# EAGLE design DAC Breakout Board_6 (EAGLE 9.6.2)
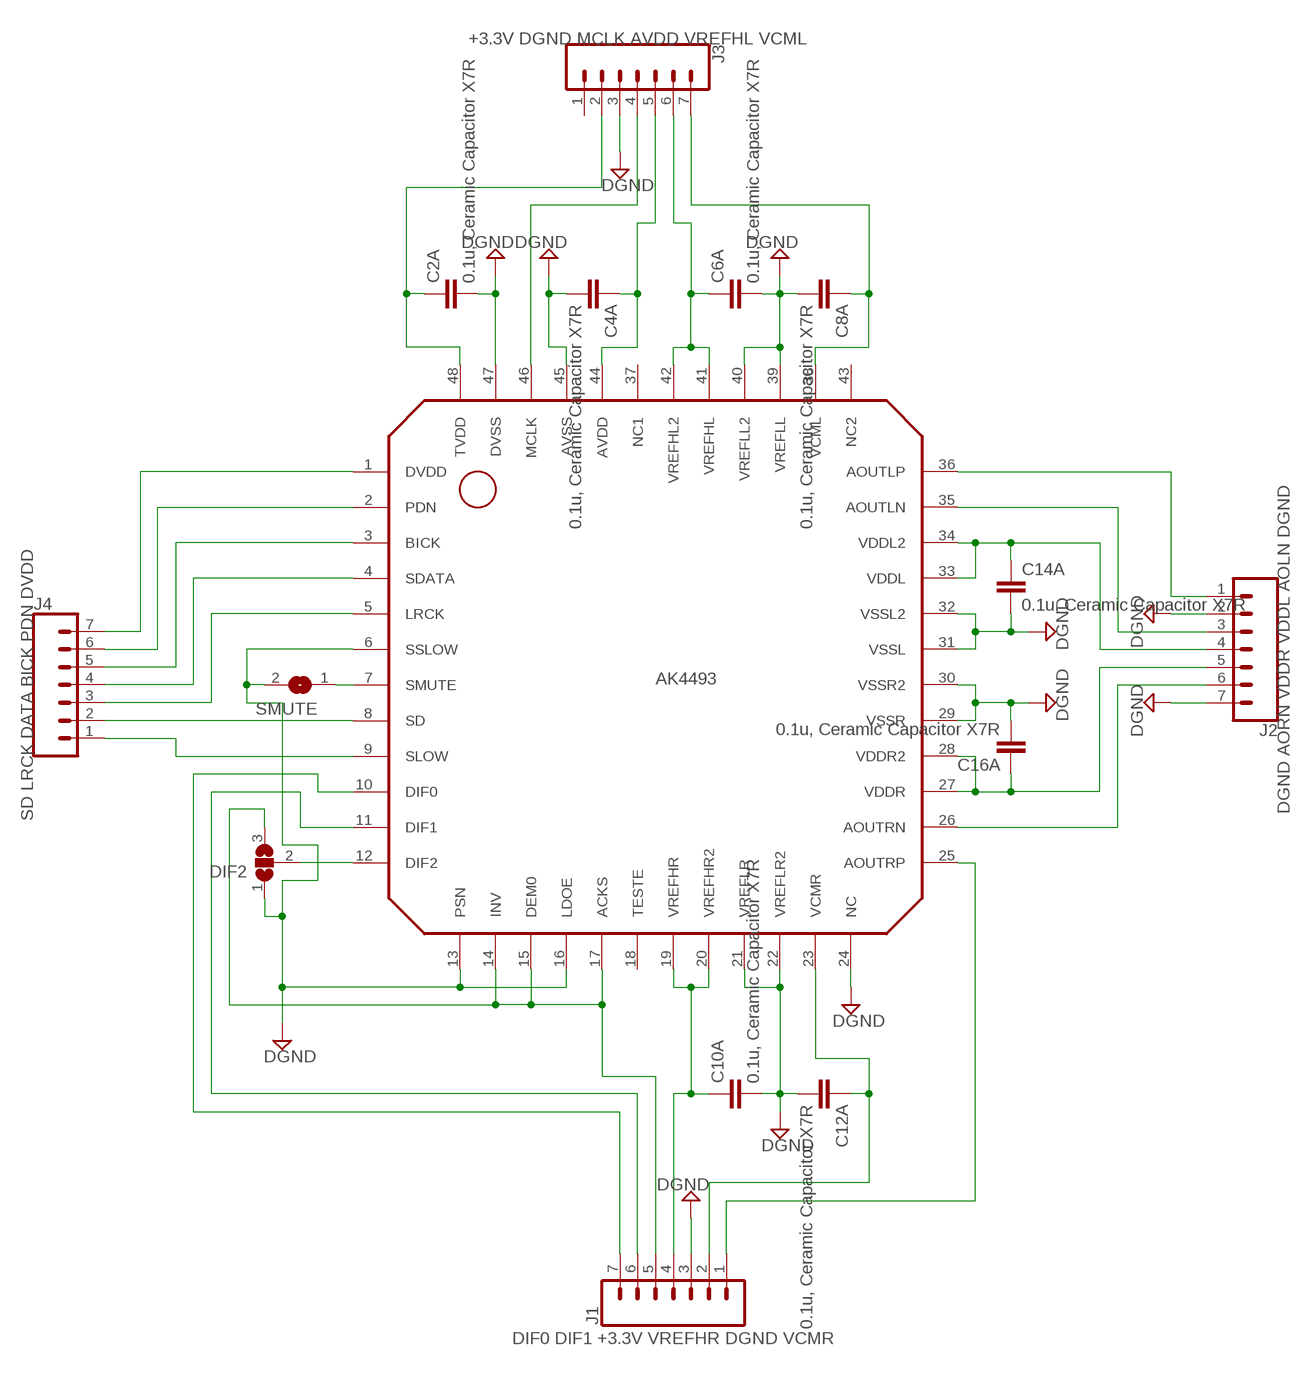
[diagram p0: schematic, sheet 1]

## Parts
C2A  0.1u, Ceramic Capacitor X7R  C-EUC0603K  [C0603K]
C4A  0.1u, Ceramic Capacitor X7R  C-EUC0603K  [C0603K]
C6A  0.1u, Ceramic Capacitor X7R  C-EUC0603K  [C0603K]
C8A  0.1u, Ceramic Capacitor X7R  C-EUC0603K  [C0603K]
C10A  0.1u, Ceramic Capacitor X7R  C-EUC0603K  [C0603K]
C12A  0.1u, Ceramic Capacitor X7R  C-EUC0603K  [C0603K]
C14A  0.1u, Ceramic Capacitor X7R  C-EUC0603K  [C0603K]
C16A  0.1u, Ceramic Capacitor X7R  C-EUC0603K  [C0603K]
DIF2  SJ2W  [SJ_2]
IC1  AK4493  [LQFP48]
J1  CONN_07  [1X07]
J2  CONN_07  [1X07]
J3  CONN_07  [1X07]
J4  CONN_07  [1X07]
SMUTE  SJ  [SJ]

## Nets
DGND: C2A.2 C4A.2 C6A.2 C8A.2 C10A.2 C12A.2 C14A.2 C16A.2 DIF2.1 IC1.6(SSLOW) IC1.13(PSN) IC1.16(LDOE) IC1.21(VREFLR) IC1.22(VREFLR2) IC1.24(NC) IC1.29(VSSR) IC1.30(VSSR2) IC1.31(VSSL) IC1.32(VSSL2) IC1.39(VREFLL) IC1.40(VREFLL2) IC1.45(AVSS) IC1.47(DVSS) J1.3 J2.2 J2.7 J3.3 SMUTE.2
N$1 [L_Audio]: IC1.36(AOUTLP) J2.1
N$2 [L_Audio]: IC1.35(AOUTLN) J2.3
N$3 [R_Audio]: IC1.25(AOUTRP) J1.1
N$4 [R_Audio]: IC1.26(AOUTRN) J2.6
N$5: IC1.11(DIF1) J1.6
N$6: IC1.9(SLOW) J4.1
N$7: C10A.1 IC1.19(VREFHR) IC1.20(VREFHR2) J1.4
N$8: IC1.10(DIF0) J1.7
N$9: IC1.5(LRCK) J4.3
N$10: IC1.4(SDATA) J4.4
N$11: IC1.3(BICK) J4.5
N$12: IC1.46(MCLK) J3.4
N$13: IC1.1(DVDD) J4.7
N$14: C4A.1 IC1.44(AVDD) J3.5
N$15: IC1.2(PDN) J4.6
N$16: C8A.1 IC1.38(VCML) J3.7
N$17: C12A.1 IC1.23(VCMR) J1.2
N$18: C6A.1 IC1.41(VREFHL) IC1.42(VREFHL2) J3.6
N$19: IC1.7(SMUTE) SMUTE.1
N$20: IC1.8(SD) J4.2
N$21: DIF2.2 IC1.12(DIF2)
N$22: C14A.1 IC1.33(VDDL) IC1.34(VDDL2) J2.4
N$23: C16A.1 IC1.27(VDDR) IC1.28(VDDR2) J2.5
N$25: C2A.1 IC1.48(TVDD) J3.2
N$26: DIF2.3 IC1.14(INV) IC1.15(DEM0) IC1.17(ACKS) J1.5
Unconnected: IC1.18(TESTE) IC1.37(NC1) IC1.43(NC2) J3.1

## Notes on the sheet
- +3.3V DGND MCLK AVDD VREFHL VCML
- DGND AORN VDDR VDDL AOLN DGND
- SD LRCK DATA BICK PDN DVDD
- DIF0 DIF1 +3.3V VREFHR DGND VCMR

## Library data of the parts
C2A C4A C6A C8A C10A C12A C14A C16A = rcl:C-EU: CAPACITOR, European symbol; SPICEPREFIX: C
DIF2 = jumper:SJ2W: SMD solder JUMPER
IC1 = akm:AK4493: Quality Oriented 32-Bit 2ch DAC 32-Bit, 768 kHz with VELVET SOUND
J1-J4 = SparkFun-Connectors:CONN_07: Multi connection point. Often used as Generic Header-pin footprint for 0.1 inch spaced/style header connections On any of the 0.1 inch spaced packages, you can populate with these: Break Away Headers - Straight <https://www.sparkfun.com/products/116> (PRT-00116) Break Away Male Headers - Right Angle <https://www.sparkfun.com/products/553> (PRT-00553) Female Headers <https://www.sparkfun.com/products/115> (PRT-00115) Break Away Headers - Machine Pin <https://www.sparkfun.com/products/117> (PRT-00117) Break Away Female Headers - Swiss Machine Pin <https://www.sparkfun.com/products/743> (PRT-00743) For SCREWTERMINALS and SPRING TERMINALS visit here: Screw Terimnals on SparkFun.com <https://www.sparkfun.com/search/results?term=Screw+Terminals> (5mm/3.5mm/2.54mm spacing) This device is also useful as a general connection point to wire up your design to another part of your project. Our various solder wires solder well into these plated through hole pads. Hook-Up Wire - Assortment (Stranded, 22 AWG) <https://www.sparkfun.com/products/11375> (PRT-11375) Hook-Up Wire - Assortment (Solid Core, 22 AWG) <https://www.sparkfun.com/products/11367> (PRT-11367) View the entire wire category on our website here <https://www.sparkfun.com/categories/141> Special notes: Molex polarized connector foot print use with SKU : PRT-08231 with associated crimp pins and housings. 1MM SMD Version SKU: PRT-10208 NOTES ON THE VARIANTS LOCK and LOCK_LONGPADS... This footprint was designed to help hold the alignment of a through-hole component (i.e. 6-pin header) while soldering it into place. You may notice that each hole has been shifted either up or down by 0.005 of an inch from it's more standard position (which is a perfectly straight line). This slight alteration caused the pins (the squares in the middle) to touch the edges of the holes. Because they are alternating, it causes a "brace" to hold the component in place. 0.005 has proven to be the perfect amount of "off-center" position when using our standard breakaway headers. Although looks a little odd when you look at the bare footprint, once you have a header in there, the alteration is very hard to notice. Also,if you push a header all the way into place, it is covered up entirely on the bottom side.
SMUTE = jumper:SJ: SMD solder JUMPER

## Board
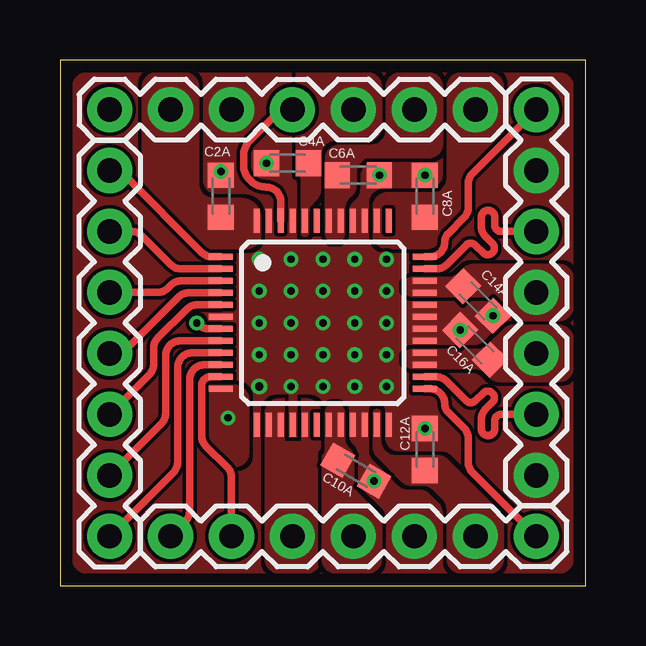
[diagram p1: board, top side]
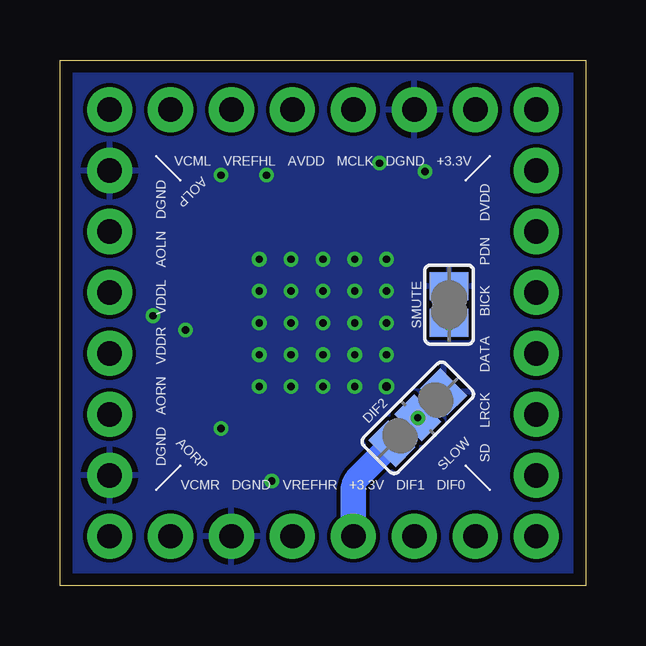
[diagram p2: board, bottom side, seen from below]

Size 21.91 x 21.91 mm. Coordinates in mm from the lower left corner, seen from the top.
Outline: 0,21.91 0,0 21.91,0 21.91,21.91 0,21.91
Copper layers (1*16): Top 0.035mm / dielectric 1.6mm / Bottom 0.035mm
Design rules "HighSpeed": minimum track width 6mil, minimum drill 12mil, track to track 6mil, track to pad 6mil, pad to pad 6mil, via to via 8mil, smd to smd 0mil, copper to edge 20mil, drill to drill 10mil, minimum pad ring 6mil, minimum via ring 6mil, stop-mask expansion 0mil, vias tented up to drill 100mil, thermal gap 10mil

### Footprints (pad centres in the part's own frame; a part is rotated, then mirrored left to right if it is on the bottom)
C0603K = smd 1.05 x 1.08: 1 -0.875,0; 2 0.875,0
SJ_2 = smd 1.168 x 1.6: 1 -1.524,0; 2 0,0; 3 1.524,0
LQFP48 = smd 0.25 x 1: 1 -2.75,-4.25; 2 -2.25,-4.25; 3 -1.75,-4.25; 4 -1.25,-4.25; 5 -0.75,-4.25; 6 -0.25,-4.25; 7 0.25,-4.25; 8 0.75,-4.25; 9 1.25,-4.25; 10 1.75,-4.25; 11 2.25,-4.25; 12 2.75,-4.25; 25 2.75,4.25; 26 2.25,4.25; 27 1.75,4.25; 28 1.25,4.25; 29 0.75,4.25; 30 0.25,4.25; 31 -0.25,4.25; 32 -0.75,4.25; 33 -1.25,4.25; 34 -1.75,4.25; 35 -2.25,4.25; 36 -2.75,4.25 | smd 1 x 0.25: 13 4.25,-2.75; 14 4.25,-2.25; 15 4.25,-1.75; 16 4.25,-1.25; 17 4.25,-0.75; 18 4.25,-0.25; 19 4.25,0.25; 20 4.25,0.75; 21 4.25,1.25; 22 4.25,1.75; 23 4.25,2.25; 24 4.25,2.75; 37 -4.25,2.75; 38 -4.25,2.25; 39 -4.25,1.75; 40 -4.25,1.25; 41 -4.25,0.75; 42 -4.25,0.25; 43 -4.25,-0.25; 44 -4.25,-0.75; 45 -4.25,-1.25; 46 -4.25,-1.75; 47 -4.25,-2.25; 48 -4.25,-2.75
1X07 = drill 1.016 pad 1.88: 1 0,0; 2 2.54,0; 3 5.08,0; 4 7.62,0; 5 10.16,0; 6 12.7,0; 7 15.24,0
SJ = smd 1.168 x 1.6: 1 -0.762,0; 2 0.762,0

### Placement (x,y rotation side)
C2A  6.71,16.24 90 top
C4A  9.48,17.61 180 top
C6A  12.43,17.11 0 top
C8A  15.21,16.24 90 top
C10A  12.33,4.8 330 top
C12A  15.21,5.68 90 top
C14A  17.42,11.87 315 top
C16A  17.3,10.04 135 top
DIF2  7,7 225 bottom
IC1  10.96,10.96 270 top
J1  19.84,2.06 180 top
J2  19.84,19.84 270 top
J3  2.06,19.84 0 top
J4  2.06,2.06 90 top
SMUTE  5.7,11.72 90 bottom

### Tracks (layer width: path | path; a pad name or v marks a point on that pad's centre or on a via)
DGND  (via drill 0.3, 0.35)
  other vias: 9.63,10.96 8.3,10.96 12.28,10.96 13.61,10.96 10.96,10.96 9.63,13.61 8.3,13.61 12.28,13.61 13.61,13.61 10.96,13.61 9.63,12.28 8.3,12.28 12.28,12.28 13.61,12.28 10.96,12.28 9.63,9.63 12.28,9.63 13.61,9.63 10.96,9.63 12.28,8.3 13.61,8.3 10.96,8.3 8.6,17.61 13.31,17.11 9.63,8.3 8.3,9.63 8.3,8.3 15.21,17.11 6.71,17.26 13.09,4.36 15.21,6.56 18.04,11.25 16.68,10.66
  pour Top (rank 6, no thermals): 1.12,21.4 20.79,21.4 arc-90 21.4,20.79 21.4,1.12 arc-90 20.79,0.51 1.12,0.51 arc-90 0.51,1.12 0.51,20.79 arc-90
  pour Bottom: 0,21.91 21.91,21.91 21.91,0 0,0
  pour Top (no thermals): 9.53,8.1 9.53,6.2 9.88,6.2 9.88,8.1
N$1
  Top 0.305: IC1.36 15.41,13.71 arc90 16.02,14.31 arc-45 16.17,14.67 16.83,15.33 arc45 17.01,15.76 17.01,16.76 arc-45 17.19,17.19 J2.1
N$2
  Top 0.305: IC1.35 15.68,13.21 arc45 16.11,13.38 16.92,14.19 arc-90 17.31,14.19 17.63,13.88 arc180 18.02,14.27 17.74,14.54 arc-45 17.56,14.97 17.56,15.38 arc-180 18.11,15.38 18.11,15.04 arc90 18.39,14.77 J2.3
N$3
  Top 0.305: IC1.25 15.41,8.21 arc-90 16.02,7.59 arc45 16.17,7.24 16.83,6.58 arc-45 17.01,6.15 17.01,5.15 arc45 17.19,4.72 J1.1
N$4
  Top 0.305: IC1.26 15.68,8.71 arc-45 16.11,8.53 16.92,7.72 arc90 17.31,7.72 17.63,8.03 arc-180 18.02,7.64 17.74,7.37 arc45 17.56,6.94 17.56,6.54 arc180 18.11,6.54 18.11,6.87 arc-90 18.39,7.14 J2.6
N$5
  Top 0.305: IC1.11 6.26,8.71 arc90 5.9,8.35 5.9,6.25 arc45 6.08,5.82 6.97,4.93 arc-45 7.14,4.5 J1.6
N$6
  Top 0.305: IC1.9 5.51,9.71 arc90 4.9,9.1 4.9,5.15 arc-45 4.72,4.72 J4.1
N$7
  pour Top (no thermals): 11.03,7.2 11.03,5.65 arc-45 10.96,5.48 arc45 10.9,5.34 10.9,1.12 arc90 11.51,0.51 12.81,0.51 arc90 13.42,1.12 13.42,2.65 arc45 13.24,3.08 12.43,3.89 arc-45 12.25,4.32 12.25,5.29 arc45 12.08,5.72 12.06,5.74 arc-45 11.88,6.17 11.88,7.2 arc180
N$8
  Top 0.305: IC1.10 6.01,9.21 arc90 5.4,8.6 5.4,3.11 arc-45 5.22,2.68 J1.7
N$9
  Top 0.305: IC1.5 5.71,11.71 arc45 5.28,11.53 4.08,10.33 arc45 3.9,9.9 3.9,9.23 arc-45 3.72,8.8 J4.3
N$10
  Top 0.305: IC1.4 5.36,12.21 arc45 4.93,12.03 2.76,9.86 arc-45 2.33,9.69 J4.4
N$11
  Top 0.305: IC1.3 5.05,12.71 arc45 4.62,12.53 4.49,12.4 arc-45 4.06,12.22 J4.5
N$12
  Top 0.305: J3.4 9.61,19.84 arc45 8.9,19.55 7.94,18.59 arc45 7.65,17.89 7.65,17.56 arc90 8.6,16.61 arc-90 9.21,16 IC1.46
N$13
  Top 0.305: IC1.1 6.35,13.71 arc-45 5.92,13.88 2.67,17.13 arc45 2.24,17.3 J4.7
N$14
  pour Top (no thermals): 12.81,21.4 9.83,21.4 9.83,17.35 arc45 9.92,17.13 9.94,17.11 arc-45 10.03,16.89 10.03,14.71 arc180 10.38,14.71 10.38,15.36 arc-45 10.67,16.06 arc45 10.88,16.56 10.88,17.93 arc-90 11.49,18.54 12.81,18.54 arc90 13.42,19.15 13.42,20.79 arc90
N$15
  Top 0.305: IC1.2 5.05,13.21 arc-45 4.62,13.38 3.41,14.59 arc45 2.98,14.77 J4.6
N$16
  pour Top (no thermals): 16.11,17.01 16.11,20.79 arc-90 16.72,21.4 17.89,21.4 arc-90 18.5,20.79 18.5,18.75 arc-45 18.32,18.32 17.19,17.19 arc45 17.01,16.76 17.01,15.76 arc-45 16.83,15.33 15.71,14.21 arc-45 15.28,14.03 13.64,14.03 arc-90 13.03,14.64 13.03,15.79 arc-90 13.64,16.4 15.5,16.4 arc90
N$17
  pour Top (no thermals): 15.54,3.99 15.93,3.6 arc-45 16.11,3.17 16.11,1.12 arc90 16.72,0.51 17.89,0.51 arc90 18.5,1.12 18.5,2.68 arc45 18.32,3.11 16.17,5.27 arc45 15.73,5.45 13.99,5.45 arc-90 13.38,6.06 13.38,7.2 arc180 13.03,7.2 13.03,5.78 arc45 13.21,5.35 14.22,4.34 arc45 14.65,4.16 15.11,4.16 arc-45
N$18
  pour Top (no thermals): 13.57,19 13.57,20.79 arc-90 14.18,21.4 15.35,21.4 arc-90 15.96,20.79 15.96,18.42 arc-90 15.35,17.81 12.97,17.81 arc90 12.36,17.2 12.36,16.69 arc-45 12.18,16.26 12.06,16.14 arc45 11.88,15.71 11.88,14.71 arc-180 11.03,14.71 11.03,17.78 arc-90 11.64,18.39 12.96,18.39 arc90
N$19  (via drill 0.3)
  Top 0.305: IC1.7 6.2,10.71 arc-45 5.77,10.88 SMUTE.1
  other vias: 5.7,10.96
N$20
  Top 0.305: IC1.8 5.01,10.21 arc90 4.4,9.6 4.4,7.19 arc-45 4.22,6.76 J4.2
N$21  (via drill 0.3)
  other vias: 7,7
  pour Top (no thermals): 7.88,5.54 7.88,7.77 arc90 7.27,8.38 5.9,8.38 5.9,6.19 arc45 6.08,5.75 6.72,5.11 arc45 7.15,4.93 7.27,4.93 arc90
N$22
  pour Top (no thermals): 14.71,12.88 arc180 14.71,12.03 17.9,12.03 arc-45 18.33,11.85 18.97,11.21 arc45 19.4,11.03 20.79,11.03 arc90 21.4,11.64 21.4,12.81 arc90 20.79,13.42 17.23,13.42 arc45 16.8,13.24 16.62,13.06 arc-45 16.19,12.88
N$23
  pour Top (no thermals): 14.71,9.03 arc-180 14.71,9.88 17.39,9.88 arc45 17.82,10.06 18.46,10.7 arc-45 18.89,10.88 20.79,10.88 arc-90 21.4,10.27 21.4,9.1 arc-90 20.79,8.49 18.32,8.49 arc-45 17.89,8.67 17.71,8.85 arc45 17.28,9.03
N$25
  pour Top (no thermals): 5.19,21.4 4.02,21.4 arc90 3.41,20.79 3.41,16.64 arc45 3.64,16.09 5.52,14.21 arc45 5.95,14.03 7.77,14.03 arc90 8.38,14.64 8.38,15.36 arc90 7.58,16.16 6.41,16.16 arc-90 5.8,16.77 5.8,20.79 arc90
N$26
  Bottom 1.016: 9.69,4.06 arc45 9.51,4.49 DIF2.3
  Bottom 1.06: J1.5 9.69,4.06
  pour Top (rank 2, no thermals): 10.88,1.12 10.88,7.2 arc90 10.27,7.81 9.14,7.81 arc90 8.53,7.2 8.53,1.12 arc90 9.14,0.51 10.27,0.51 arc90

### Text on the board
bNames: VCML VREFHL AVDD MCLK DGND +3.3V | AOLP | SD LRCK DATA BICK PDN DVDD | DGND AORN VDDR VDDL AOLN DGND | SLOW | AORP | VCMR DGND VREFHR +3.3V DIF1 DIF0